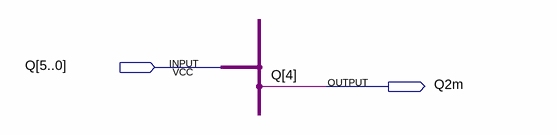
[diagram p0: schematic sheet]
// Quartus schematic GeneradorQ2.bdf as structural Verilog: 0 symbols, 2 pins
module GeneradorQ2 (
  input  [5:0] Q,
  output Q2m
);


  assign Q2m = Q[4];
endmodule
